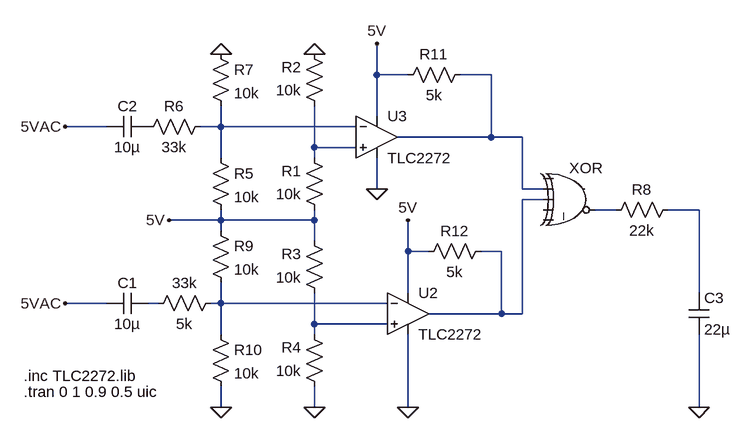
[diagram p0: schematic Draft5.asc]
Draft5.asc, the LTspice schematic file:
Version 4
SHEET 1 880 680
WIRE -400 -448 -400 -496
WIRE -352 -448 -400 -448
WIRE -224 -448 -272 -448
WIRE -400 -384 -400 -448
WIRE -816 -368 -880 -368
WIRE -640 -368 -640 -400
WIRE -640 -368 -672 -368
WIRE -432 -368 -640 -368
WIRE -224 -352 -224 -448
WIRE -224 -352 -368 -352
WIRE -176 -352 -224 -352
WIRE -496 -336 -496 -400
WIRE -432 -336 -496 -336
WIRE -640 -320 -640 -368
WIRE -496 -320 -496 -336
WIRE -400 -272 -400 -320
WIRE -176 -272 -176 -352
WIRE -144 -272 -176 -272
WIRE -144 -256 -176 -256
WIRE -32 -240 -64 -240
WIRE 96 -240 48 -240
WIRE -640 -224 -640 -240
WIRE -640 -224 -720 -224
WIRE -496 -224 -496 -240
WIRE -496 -224 -640 -224
WIRE -640 -208 -640 -224
WIRE -496 -192 -496 -224
WIRE -352 -176 -352 -224
WIRE -320 -176 -352 -176
WIRE -208 -176 -240 -176
WIRE -352 -112 -352 -176
WIRE 96 -112 96 -240
WIRE -816 -96 -880 -96
WIRE -736 -96 -752 -96
WIRE -640 -96 -640 -128
WIRE -640 -96 -656 -96
WIRE -384 -96 -640 -96
WIRE -208 -80 -208 -176
WIRE -208 -80 -320 -80
WIRE -176 -80 -176 -256
WIRE -176 -80 -208 -80
WIRE -496 -64 -496 -112
WIRE -384 -64 -496 -64
WIRE -640 -48 -640 -96
WIRE -496 -48 -496 -64
WIRE -640 64 -640 32
WIRE -496 64 -496 32
WIRE -352 64 -352 -48
WIRE 96 64 96 -48
FLAG -496 64 0
FLAG -352 64 0
FLAG -400 -272 0
FLAG -496 -480 0
FLAG -640 64 0
FLAG -640 -480 0
FLAG 96 64 0
FLAG -880 -96 5VAC
FLAG -880 -368 5VAC
FLAG -400 -496 5V
FLAG -352 -224 5V
FLAG -720 -224 5V
SYMBOL res -48 -224 R270
WINDOW 0 32 56 VTop 2
WINDOW 3 0 56 VBottom 2
SYMATTR InstName R8
SYMATTR Value 22k
SYMBOL cap 80 -112 R0
SYMATTR InstName C3
SYMATTR Value 22µ
SYMBOL cap -816 -80 R270
WINDOW 0 32 32 VTop 2
WINDOW 3 0 32 VBottom 2
SYMATTR InstName C1
SYMATTR Value 10µ
SYMBOL res -752 -80 R270
WINDOW 0 32 56 VTop 2
WINDOW 3 0 56 VBottom 2
SYMATTR InstName 33k
SYMATTR Value 5k
SYMBOL res -480 -224 R180
WINDOW 0 36 76 Left 2
WINDOW 3 36 40 Left 2
SYMATTR InstName R1
SYMATTR Value 10k
SYMBOL res -480 -384 R180
WINDOW 0 36 76 Left 2
WINDOW 3 36 40 Left 2
SYMATTR InstName R2
SYMATTR Value 10k
SYMBOL res -480 -96 R180
WINDOW 0 36 76 Left 2
WINDOW 3 36 40 Left 2
SYMATTR InstName R3
SYMATTR Value 10k
SYMBOL res -480 48 R180
WINDOW 0 36 76 Left 2
WINDOW 3 36 40 Left 2
SYMATTR InstName R4
SYMATTR Value 10k
SYMBOL res -656 -336 R0
SYMATTR InstName R5
SYMATTR Value 10k
SYMBOL res -656 -496 R0
SYMATTR InstName R7
SYMATTR Value 10k
SYMBOL res -656 -224 R0
SYMATTR InstName R9
SYMATTR Value 10k
SYMBOL res -656 -64 R0
SYMATTR InstName R10
SYMATTR Value 10k
SYMBOL cap -816 -352 R270
WINDOW 0 32 32 VTop 2
WINDOW 3 0 32 VBottom 2
SYMATTR InstName C2
SYMATTR Value 10µ
SYMBOL res -768 -352 R270
WINDOW 0 32 56 VTop 2
WINDOW 3 0 56 VBottom 2
SYMATTR InstName R6
SYMATTR Value 33k
SYMBOL res -336 -160 R270
WINDOW 0 32 56 VTop 2
WINDOW 3 0 56 VBottom 2
SYMATTR InstName R12
SYMATTR Value 5k
SYMBOL Opamps\\opamp2 -352 -144 R0
SYMATTR InstName U2
SYMATTR Value TLC2272
SYMATTR SpiceModel TLC2272
SYMBOL Opamps\\opamp2 -400 -416 R0
SYMATTR InstName U3
SYMATTR Value TLC2272
SYMATTR SpiceModel TLC2272
SYMBOL res -368 -432 R270
WINDOW 0 32 56 VTop 2
WINDOW 3 0 56 VBottom 2
SYMATTR InstName R11
SYMATTR Value 5k
SYMBOL Digital\\xor -96 -320 R0
SYMATTR InstName XOR
TEXT -944 40 Left 2 !.tran 0 1 0.9 0.5 uic
TEXT -944 16 Left 2 !.inc TLC2272.lib

The netlist it stands for:
* Draft5.asc
R8 N005 N006 22k
C3 N006 0 22µ
C1 5VAC N007 10µ
R§33k N007 N008 5k
R1 5V N003 10k
R2 N003 0 10k
R3 N009 5V 10k
R4 0 N009 10k
R5 N002 5V 10k
R7 0 N002 10k
R9 5V N008 10k
R10 N008 0 10k
C2 5VAC P001 10µ
R6 P001 N002 33k
R12 5V N004 5k
XU2 N009 N008 5V 0 N004 TLC2272 TLC2272  ; pins In+ In- V+ V- OUT
XU3 N003 N002 5V 0 N001 TLC2272 TLC2272  ; pins In+ In- V+ V- OUT
R11 5V N001 5k
A§XOR 0 N001 N004 0 0 N005 0 0 XOR
.tran 0 1 0.9 0.5 uic
.inc TLC2272.lib
.backanno
.end